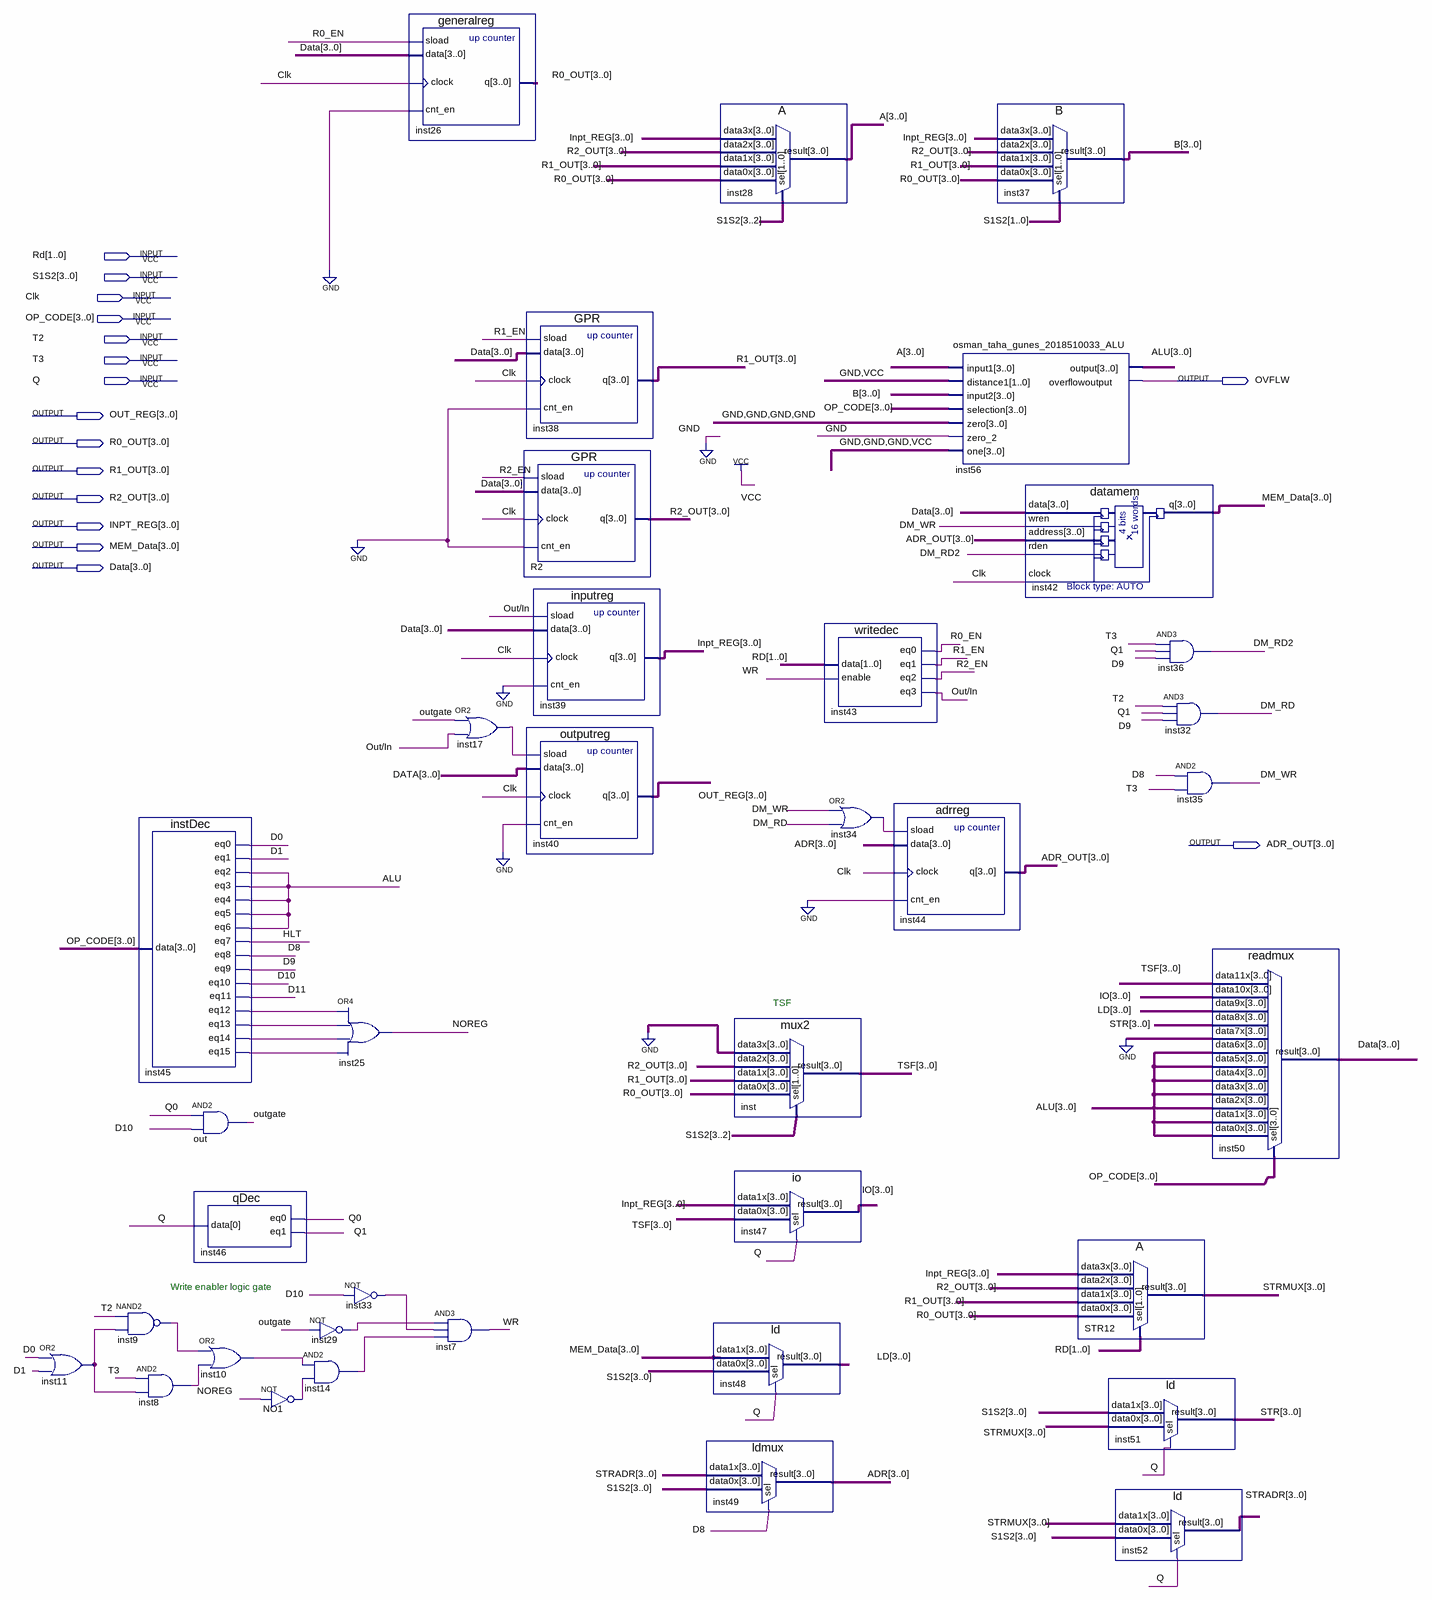
[diagram p0: schematic sheet]
// Quartus schematic 2018510033_osman_taha_gunes_newBUS.bdf as structural Verilog: 37 symbols, 16 pins
module \2018510033_osman_taha_gunes_newBUS  (
  input  [1:0] Rd,
  input  [3:0] S1S2,
  input  Clk,
  input  [3:0] OP_CODE,
  input  T2,
  input  T3,
  input  Q,
  output OVFLW,
  output [3:0] OUT_REG,
  output [3:0] R0_OUT,
  output [3:0] R1_OUT,
  output [3:0] R2_OUT,
  output [3:0] INPT_REG,
  output [3:0] MEM_Data,
  output [3:0] Data,
  output [3:0] ADR_OUT
);

  wire ALU_1bit, D0, D1, D8, D9, D10, D11, DM_RD, DM_RD2, DM_WR, HLT, inst8_out, inst9_out, inst10_out,
       inst11_out, inst14_out, inst17_out, inst29_out, inst33_out, inst34_out, inst45_eq12, inst45_eq13,
       inst45_eq14, inst45_eq15, NO1_out, NOREG, \Out/In , outgate, Q0, Q1, R0_EN, R1_EN, R2_EN, WR;
  wire [3:0] A, ADR, ALU, B, IO, LD, STR, STRADR, STRMUX, TSF;

  or inst11 (inst11_out, D0, D1);
  nand inst9 (inst9_out, T2, inst11_out);
  instDec inst45 (
    .data(OP_CODE), .eq0(D0), .eq1(D1), .eq2(ALU_1bit), .eq3(ALU_1bit), .eq4(ALU_1bit), .eq5(ALU_1bit),
    .eq6(ALU_1bit), .eq7(HLT), .eq8(D8), .eq9(D9), .eq10(D10), .eq11(D11), .eq12(inst45_eq12),
    .eq13(inst45_eq13), .eq14(inst45_eq14), .eq15(inst45_eq15));
  and inst8 (inst8_out, T3, inst11_out);
  and out (outgate, Q0, D10);
  qDec inst46 (.data(Q), .eq0(Q0), .eq1(Q1));
  or inst10 (inst10_out, inst9_out, inst8_out);
  not NO1 (NO1_out, NOREG);
  or inst25 (NOREG, inst45_eq12, inst45_eq13, inst45_eq14, inst45_eq15);
  not inst29 (inst29_out, outgate);
  and inst14 (inst14_out, inst10_out, NO1_out);
  not inst33 (inst33_out, D10);
  generalreg inst26 (.sload(R0_EN), .data(Data), .clock(Clk), .cnt_en(1'b0), .q(R0_OUT));
  and inst7 (WR, inst29_out, inst33_out, inst14_out);
  or inst17 (inst17_out, outgate, \Out/In );
  GPR inst38 (.sload(R1_EN), .data(Data), .clock(Clk), .cnt_en(1'b0), .q(R1_OUT));
  GPR R2 (.sload(R2_EN), .data(Data), .clock(Clk), .cnt_en(1'b0), .q(R2_OUT));
  inputreg inst39 (.sload(\Out/In ), .data(Data), .clock(Clk), .cnt_en(1'b0), .q(INPT_REG));
  outputreg inst40 (.sload(inst17_out), .data(Data), .clock(Clk), .cnt_en(1'b0), .q(OUT_REG));
  A inst28 (.data3x(INPT_REG), .data2x(R2_OUT), .data1x(R1_OUT), .data0x(R0_OUT), .sel(S1S2[3:2]), .result(A));
  ld inst48 (.data1x(MEM_Data), .data0x(S1S2), .sel(Q), .result(LD));
  ldmux inst49 (.data1x(STRADR), .data0x(S1S2), .sel(D8), .result(ADR));
  mux2 inst (.data3x(4'b0000), .data2x(R2_OUT), .data1x(R1_OUT), .data0x(R0_OUT), .sel(S1S2[3:2]), .result(TSF));
  io inst47 (.data1x(INPT_REG), .data0x(TSF), .sel(Q), .result(IO));
  writedec inst43 (.data(Rd), .enable(WR), .eq0(R0_EN), .eq1(R1_EN), .eq2(R2_EN), .eq3(\Out/In ));
  or inst34 (inst34_out, DM_WR, DM_RD);
  adrreg inst44 (.sload(inst34_out), .data(ADR), .clock(Clk), .cnt_en(1'b0), .q(ADR_OUT));
  B inst37 (.data3x(INPT_REG), .data2x(R2_OUT), .data1x(R1_OUT), .data0x(R0_OUT), .sel(S1S2[1:0]), .result(B));
  osman_taha_gunes_2018510033_ALU inst56 (
    .input1(A), .distance1(2'b01), .input2(B), .selection(OP_CODE), .zero(4'b0000), .zero_2(1'b0),
    .one(4'b0001), .\output (ALU), .overflowoutput(OVFLW));
  datamem inst42 (.data(Data), .wren(DM_WR), .address(ADR_OUT), .rden(DM_RD2), .clock(Clk), .q(MEM_Data));
  A STR12 (.data3x(INPT_REG), .data2x(R2_OUT), .data1x(R1_OUT), .data0x(R0_OUT), .sel(Rd), .result(STRMUX));
  ld inst51 (.data1x(S1S2), .data0x(STRMUX), .sel(Q), .result(STR));
  and inst36 (DM_RD2, T3, Q1, D9);
  and inst32 (DM_RD, T2, Q1, D9);
  ld inst52 (.data1x(STRMUX), .data0x(S1S2), .sel(Q), .result(STRADR));
  and inst35 (DM_WR, D8, T3);
  readmux inst50 (
    .data11x(TSF), .data10x(IO), .data9x(LD), .data8x(STR), .data7x(4'b0000), .data6x(ALU), .data5x(ALU),
    .data4x(ALU), .data3x(ALU), .data2x(ALU), .data1x(ALU), .data0x(ALU), .sel(OP_CODE), .result(Data));

  // Notes on the sheet:
  //   TSF
  //   Write enabler logic gate
endmodule
